# Altium schematic sheet [04] - SIGNAL BLOCK DIAGRAM.SchDoc: Signal Block Diagram
size 431 x 279 mm; SheetNumber: 4; SheetTotal: 4
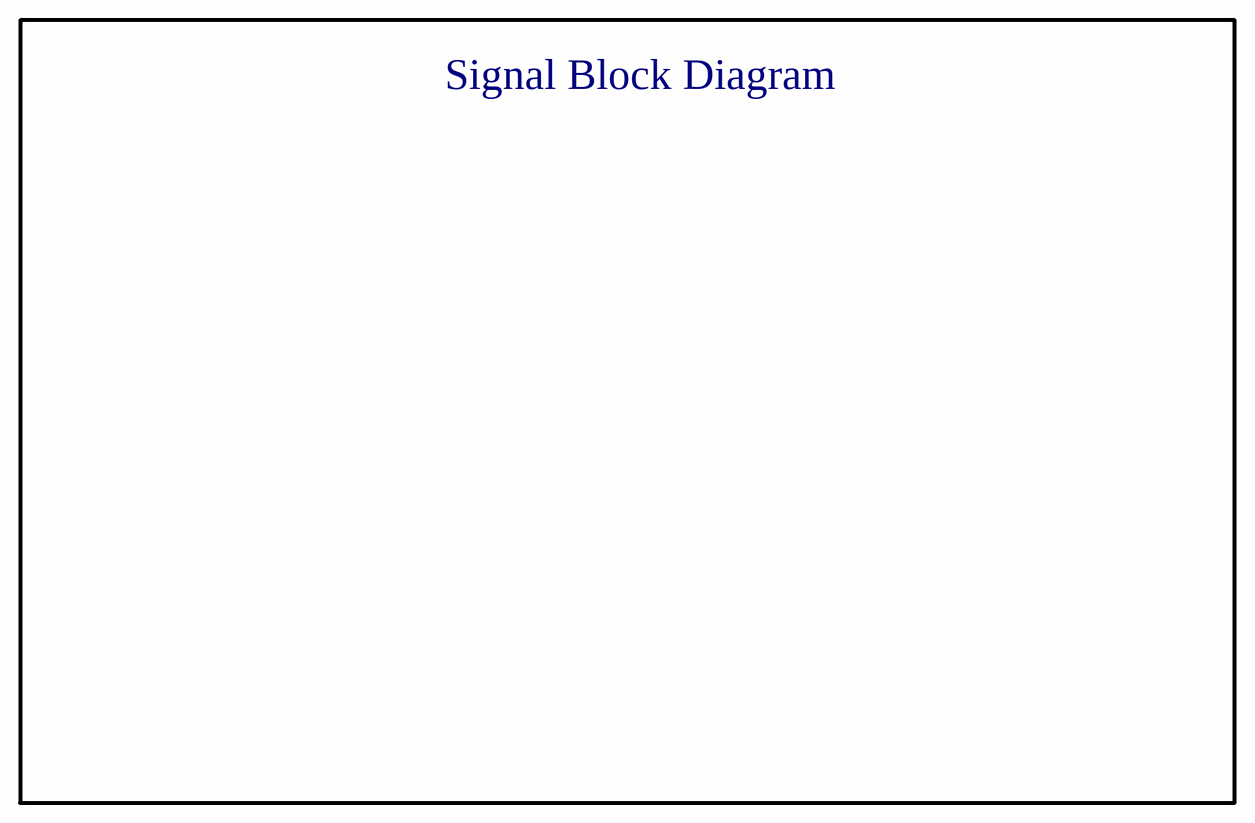
[diagram p0: [04] - SIGNAL BLOCK DIAGRAM.SchDoc]

## Notes on the sheet
- Signal Block Diagram
- CONFIDENTIALITY NOTICE. THIS DRAWING AND INFORMATION CONTAINED HEREIN ARE THE EXCLUSIVE PROPERTY OF [[COMPANY NAME]] NEITHER THIS DESIGN NOR ANY INFORMATION CONTAINED IN THIS DRAWING MAY BE REPRODUCED OR DISCLOSED WITHOUT THE EXPRESS WRITTEN CONSENT OF [[COMPANY NAME]].
- PCB Part Number:
- PCB Rev.:
- PCB Variant:
- Replaces PCB P/N & Rev.:
- SHEET TITLE:
- SIZE
- B
- Time Stamp:
- Doc. No.:
- Doc. Rev.:
- Doc. Status:
- Sheet
- of